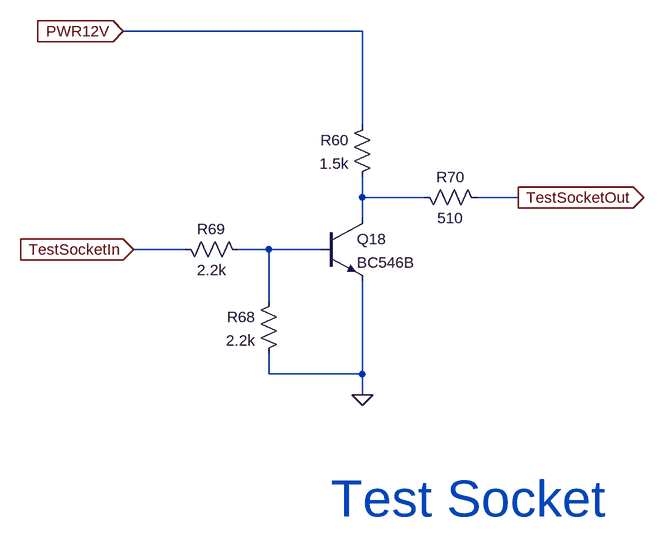
[diagram p0: schematic dme_analog_test_socket.asc]
dme_analog_test_socket.asc, the LTspice schematic file:
Version 4
SHEET 1 4356 3824
WIRE 2080 2560 1712 2560
WIRE 2080 2704 2080 2560
WIRE 2080 2816 2080 2784
WIRE 2176 2816 2080 2816
WIRE 2320 2816 2256 2816
WIRE 2080 2848 2080 2816
WIRE 1808 2896 1728 2896
WIRE 1936 2896 1888 2896
WIRE 2016 2896 1936 2896
WIRE 1936 2976 1936 2896
WIRE 1936 3088 1936 3056
WIRE 2080 3088 2080 2944
WIRE 2080 3088 1936 3088
WIRE 2080 3120 2080 3088
FLAG 2080 3120 0
FLAG 1728 2896 TestSocketIn
IOPIN 1728 2896 In
FLAG 2320 2816 TestSocketOut
IOPIN 2320 2816 Out
FLAG 1712 2560 PWR12V
IOPIN 1712 2560 In
SYMBOL npn 2016 2848 R0
SYMATTR InstName Q18
SYMATTR Value BC546B
SYMBOL Res 2096 2688 M0
SYMATTR InstName R60
SYMATTR Value 1.5k
SYMBOL Res 1952 2960 M0
SYMATTR InstName R68
SYMATTR Value 2.2k
SYMBOL Res 1792 2880 M90
WINDOW 0 0 56 VBottom 2
WINDOW 3 32 56 VTop 2
SYMATTR InstName R69
SYMATTR Value 2.2k
SYMBOL Res 2160 2800 M90
WINDOW 0 0 56 VBottom 2
WINDOW 3 32 56 VTop 2
SYMATTR InstName R70
SYMATTR Value 510
TEXT 2032 3280 Left 6 ;Test Socket

The netlist it stands for:
* dme_analog_test_socket.asc
Q18 N001 N002 0 0 BC546B
R60 PWR12V N001 1.5k
R68 N002 0 2.2k
R69 TestSocketIn N002 2.2k
R70 N001 TestSocketOut 510
.model NPN NPN
.model PNP PNP
.lib standard.bjt
* Test Socket
.backanno
.end